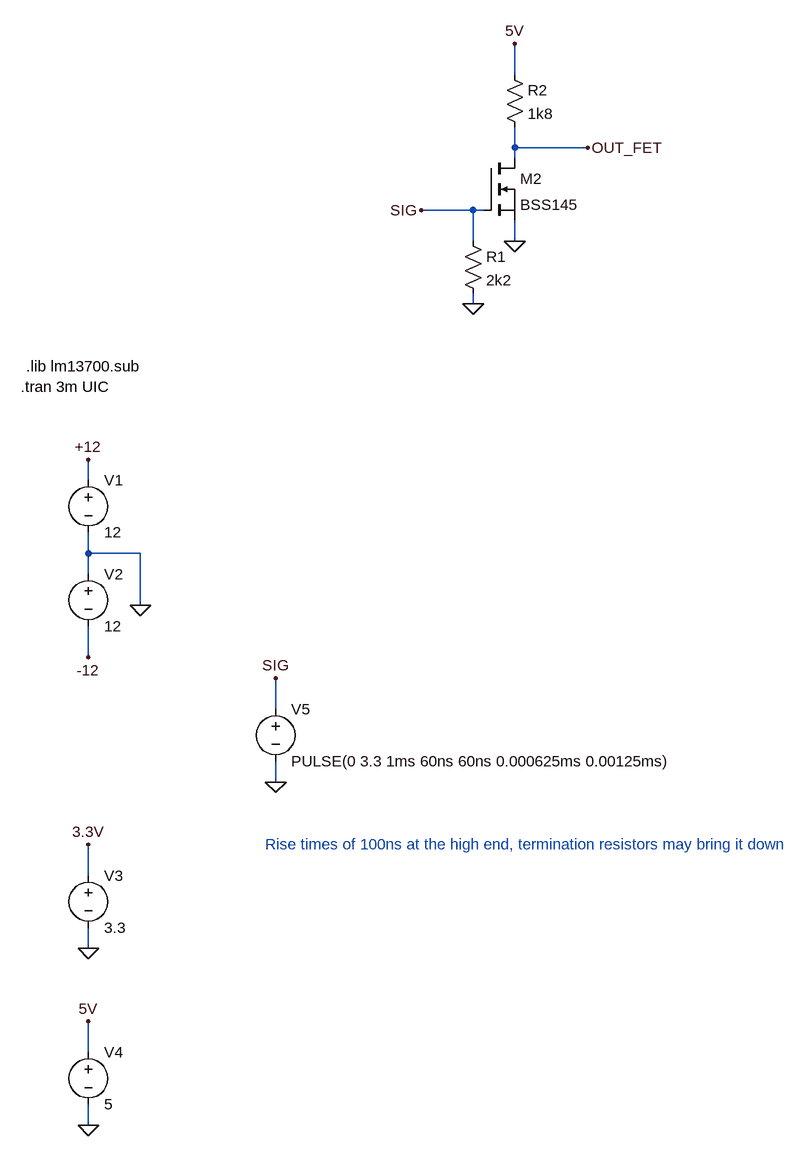
[diagram p0: schematic LvlShifterSim.asc]
LvlShifterSim.asc, the LTspice schematic file:
Version 4
SHEET 1 3368 3520
WIRE 720 -368 720 -416
WIRE 720 -256 720 -288
WIRE 832 -256 720 -256
WIRE 720 -240 720 -256
WIRE 656 -160 576 -160
WIRE 672 -160 656 -160
WIRE 656 -112 656 -160
WIRE 720 -112 720 -144
WIRE 656 -16 656 -32
WIRE 64 256 64 224
WIRE 64 368 64 336
WIRE 144 368 64 368
WIRE 64 400 64 368
WIRE 144 448 144 368
WIRE 64 528 64 480
WIRE 352 608 352 560
WIRE 352 720 352 688
WIRE 64 864 64 816
WIRE 64 976 64 944
WIRE 64 1136 64 1088
WIRE 64 1248 64 1216
FLAG 64 224 +12
FLAG 64 528 -12
FLAG 144 448 0
FLAG 64 816 3.3V
FLAG 64 976 0
FLAG 64 1088 5V
FLAG 64 1248 0
FLAG 352 560 SIG
FLAG 352 720 0
FLAG 720 -112 0
FLAG 720 -416 5V
FLAG 576 -160 SIG
FLAG 832 -256 OUT_FET
FLAG 656 -16 0
SYMBOL voltage 64 240 R0
SYMATTR InstName V1
SYMATTR Value 12
SYMBOL voltage 64 384 R0
SYMATTR InstName V2
SYMATTR Value 12
SYMBOL voltage 64 848 R0
SYMATTR InstName V3
SYMATTR Value 3.3
SYMBOL voltage 64 1120 R0
SYMATTR InstName V4
SYMATTR Value 5
SYMBOL voltage 352 592 R0
SYMATTR InstName V5
SYMATTR Value PULSE(0 3.3 1ms 60ns 60ns 0.000625ms 0.00125ms)
SYMBOL nmos 672 -240 R0
SYMATTR InstName M2
SYMATTR Value BSS145
SYMBOL res 704 -384 R0
SYMATTR InstName R2
SYMATTR Value 1k8
SYMBOL res 640 -128 R0
SYMATTR InstName R1
SYMATTR Value 2k2
TEXT -40 112 Left 2 !.tran 3m UIC
TEXT -32 80 Left 2 !.lib lm13700.sub
TEXT 336 816 Left 2 ;Rise times of 100ns at the high end, termination resistors may bring it down

The netlist it stands for:
* LvlShifterSim.asc
V1 +12 0 12
V2 0 -12 12
V3 3.3V 0 3.3
V4 5V 0 5
V5 SIG 0 PULSE(0 3.3 1ms 60ns 60ns 0.000625ms 0.00125ms)
M2 OUT_FET SIG 0 0 BSS145
R2 5V OUT_FET 1k8
R1 SIG 0 2k2
.model NMOS NMOS
.model PMOS PMOS
.lib standard.mos
.tran 3m UIC
.lib lm13700.sub
* Rise times of 100ns at the high end, termination resistors may bring it down
.backanno
.end